# EasyEDA schematic SCH_555circuit_2024-04-28.json
TITLE: Sheet_1; REV: 1.0; Date: 2024-04-22; Sheet: 1/1; Drawn By: tonyqug; Company: Your Company
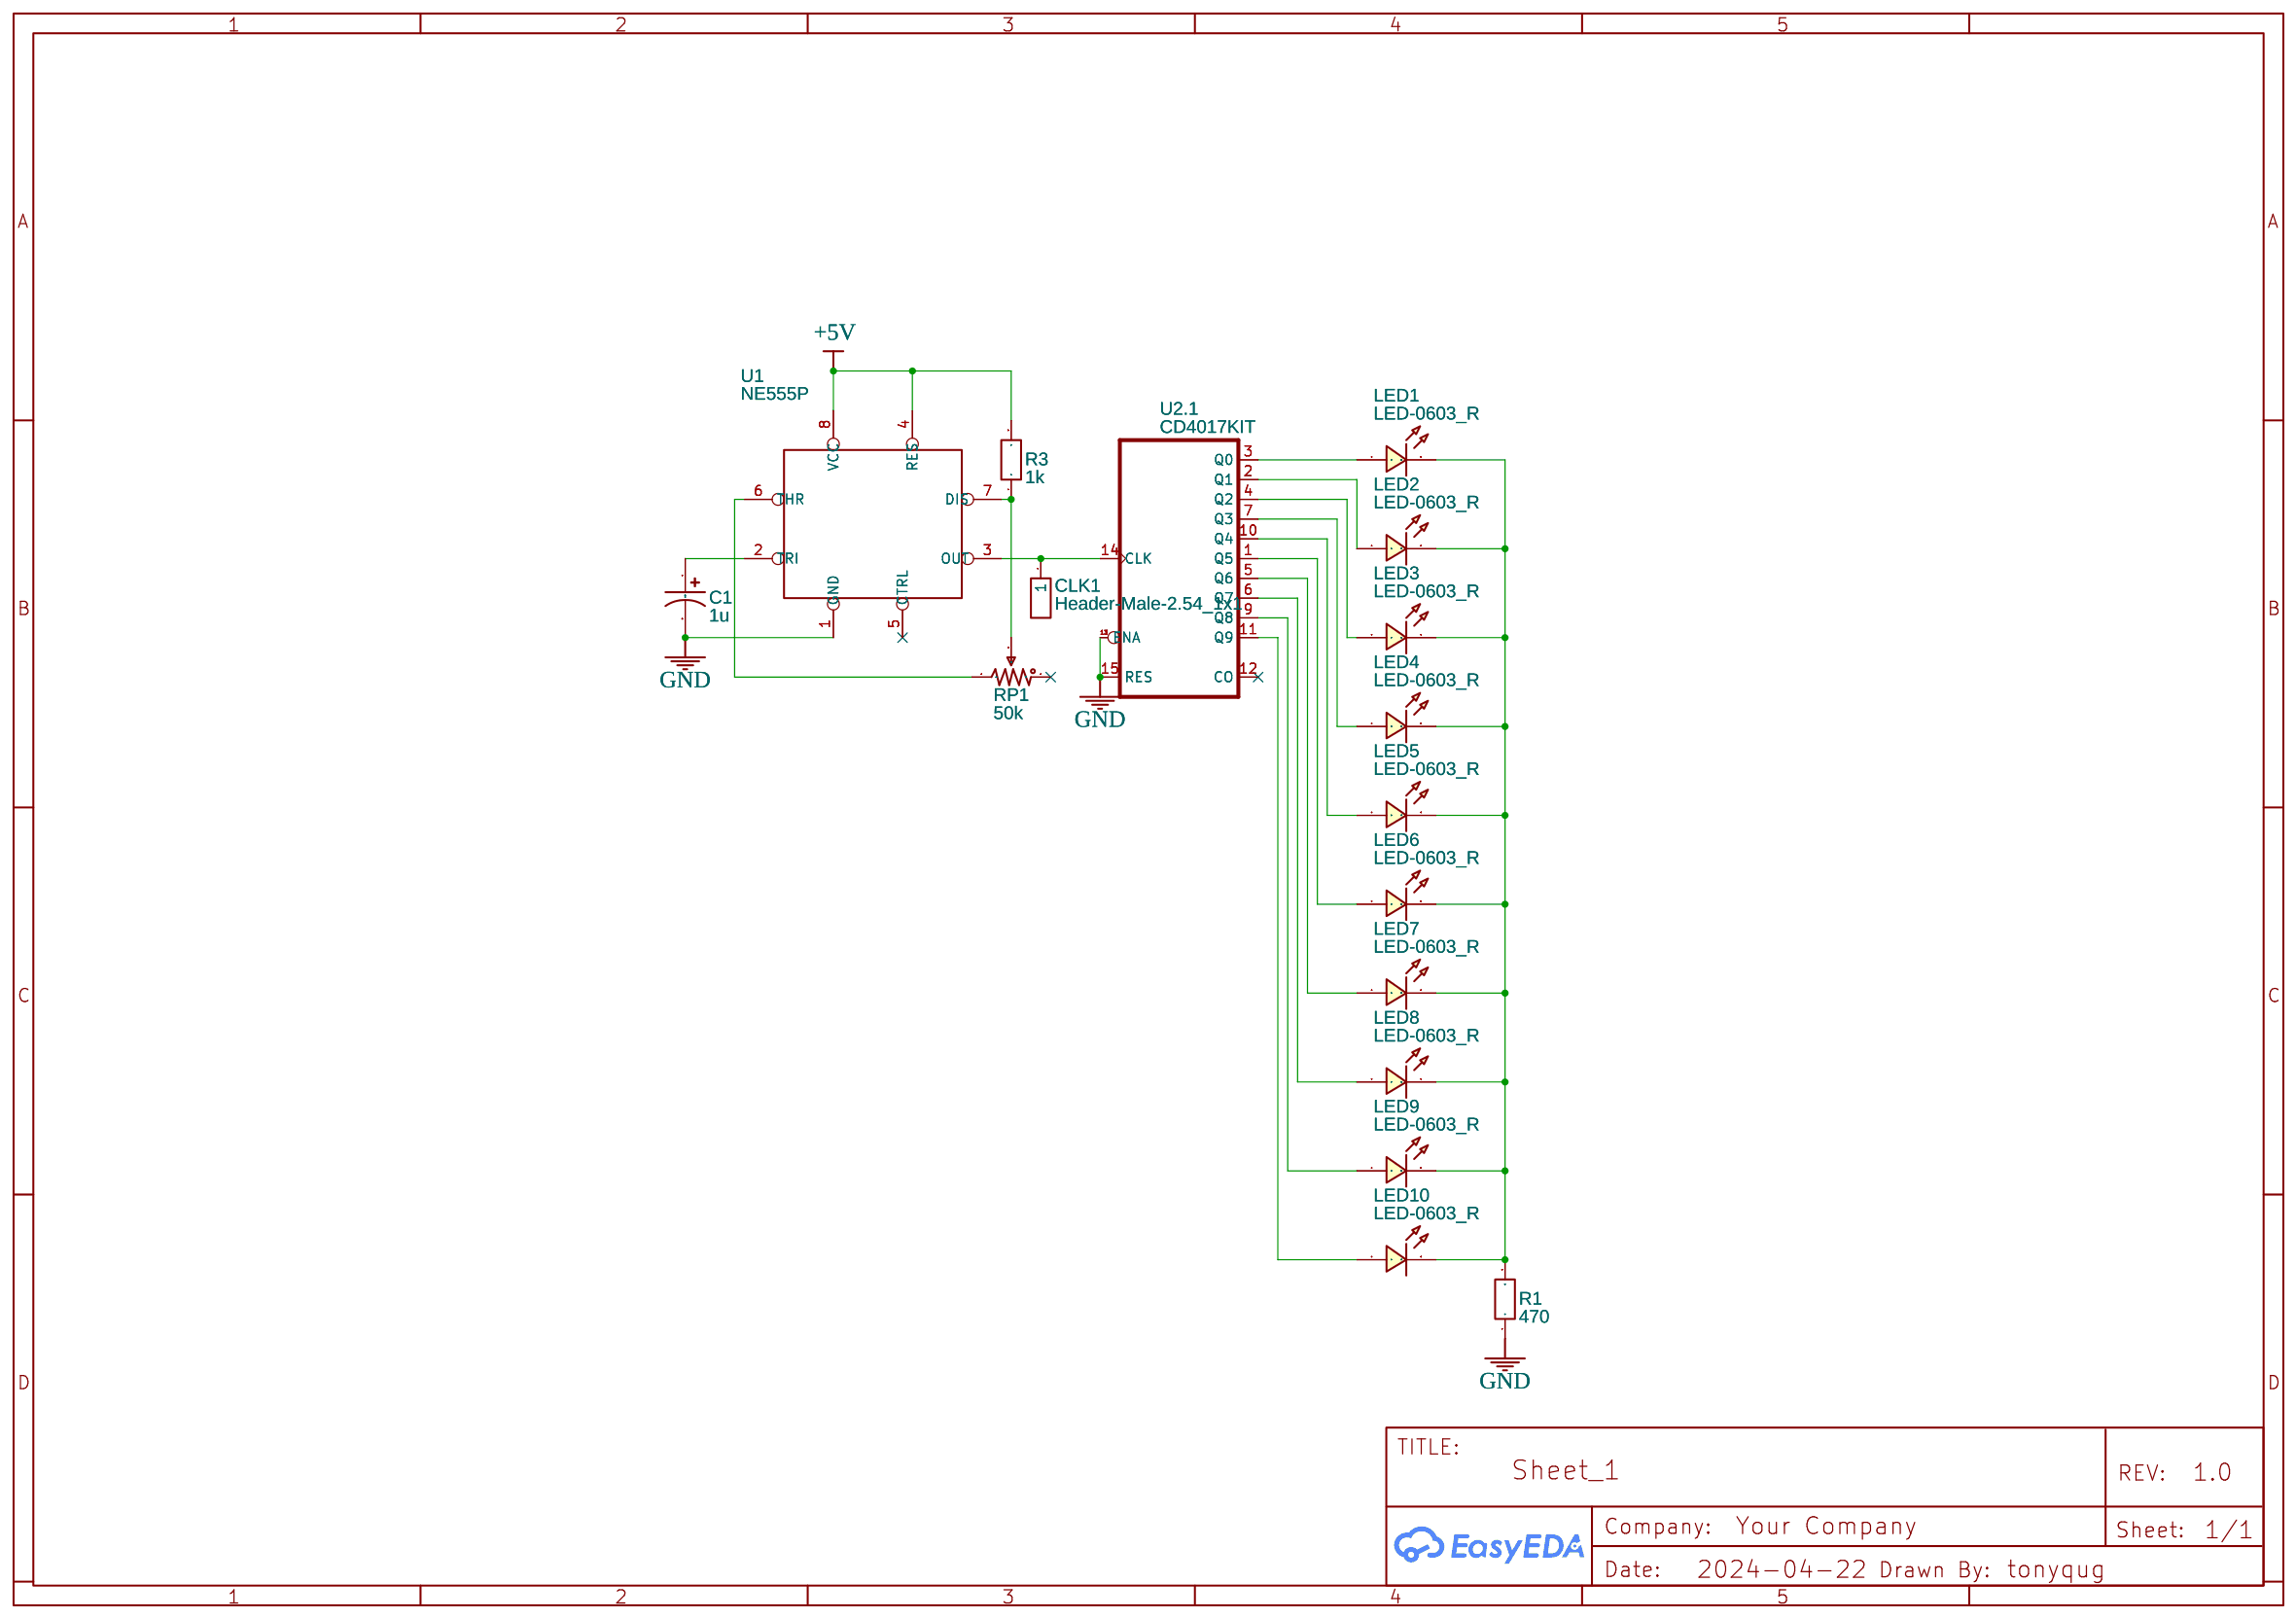
[diagram p0: schematic sheet]

## Parts
C1  1u  [CAP-TH_BD5.0-P2.00-D0.8-FD]
CLK1  Header-Male-2.54_1x1  [HDR-TH_1P-P2.54-V-M]
LED1  LED-0603_R  [LED-TH_BD5.0-P2.54-FD_C9900023552]
LED2  LED-0603_R  [LED-TH_BD5.0-P2.54-FD_C9900023552]
LED3  LED-0603_R  [LED-TH_BD5.0-P2.54-FD_C9900023552]
LED4  LED-0603_R  [LED-TH_BD5.0-P2.54-FD_C9900023552]
LED5  LED-0603_R  [LED-TH_BD5.0-P2.54-FD_C9900023552]
LED6  LED-0603_R  [LED-TH_BD5.0-P2.54-FD_C9900023552]
LED7  LED-0603_R  [LED-TH_BD5.0-P2.54-FD_C9900023552]
LED8  LED-0603_R  [LED-TH_BD5.0-P2.54-FD_C9900023552]
LED9  LED-0603_R  [LED-TH_BD5.0-P2.54-FD_C9900023552]
LED10  LED-0603_R  [LED-TH_BD5.0-P2.54-FD_C9900023552]
R1  470  [RES-TH_BD3.3-L9.0-P13.00-D0.6]
R3  1k  [R_AXIAL-0.3]
RP1  50k  [RES-ADJ_3296X]
U1  NE555P  [DIP-8_L9.8-W6.6-P2.54-LS7.6-BL]
U2  CD4017KIT  [DIP-16_L19.8-W6.5-P2.54-LS7.6-BL]  (section 1)

## Library data of the parts
C1 = C_Tan_SMD_A_US: Supplier Part: C62934; Supplier: LCSC; Contributor: LCEDA_Lib
CLK1 = Header-Male-2.54_1x1: Supplier: LCSC; Manufacturer: BOOMELE(博穆精密); Manufacturer Part: 2.54-1*1P针; Supplier Part: C81276; JLCPCB Part Class: Extended Part
LED1-LED10 = LED-0603_R: Manufacturer: EVERLIGHT(台湾亿光); Manufacturer Part: 19-217/R6C-AL1M2VY/3T; Supplier Part: C2992663; Supplier: LCSC; Contributor: LCEDA_01
R1 = R_0603_EU: Supplier Part: C58592; Supplier: LCSC; Contributor: LCEDA_Lib
R3 = R_0603_EU: Supplier Part: C713997; Supplier: LCSC; Contributor: LCEDA_Lib
RP1 = R_3386P_US: Supplier Part: C118912; Supplier: LCSC; Contributor: LCEDA_Lib; value(Ω): 50K; Package Display: No
U1 = NE555P: Supplier: LCSC; Manufacturer: TI(德州仪器); Supplier Part: C46749; JLCPCB Part Class: Extended Part
U2 = CD4017KIT: 10-Out Decade Counter; subpart_no: 1; Supplier: LCSC; Supplier Part: C34519; Package Display: No

## Nets
+5V: R3.2 U1.4(RES) U1.8(VCC)
GND: C1.2 R1.1 U1.1(GND) U2.13(ENA) U2.15(RES)
Net-(C1-1): C1.1 U1.2(TRI)
Net-(CLK1-1): CLK1.1 U1.3(OUT) U2.14(CLK)
Net-(LED1-1): LED1.1 U2.3(Q0)
Net-(LED1-2): LED1.2 LED2.2 LED3.2 LED4.2 LED5.2 LED6.2 LED7.2 LED8.2 LED9.2 LED10.2 R1.2
Net-(LED2-1): LED2.1 U2.2(Q1)
Net-(LED3-1): LED3.1 U2.4(Q2)
Net-(LED4-1): LED4.1 U2.7(Q3)
Net-(LED5-1): LED5.1 U2.10(Q4)
Net-(LED6-1): LED6.1 U2.1(Q5)
Net-(LED7-1): LED7.1 U2.5(Q6)
Net-(LED8-1): LED8.1 U2.6(Q7)
Net-(LED9-1): LED9.1 U2.9(Q8)
Net-(LED10-1): LED10.1 U2.11(Q9)
Net-(R3-1): R3.1 RP1.2 U1.7(DIS)
Net-(RP1-3): RP1.3 U1.6(THR)

Not connected (* = marked no-connect by the designer): RP1 1*; U1 5(CTRL)*; U2 12(CO)*
